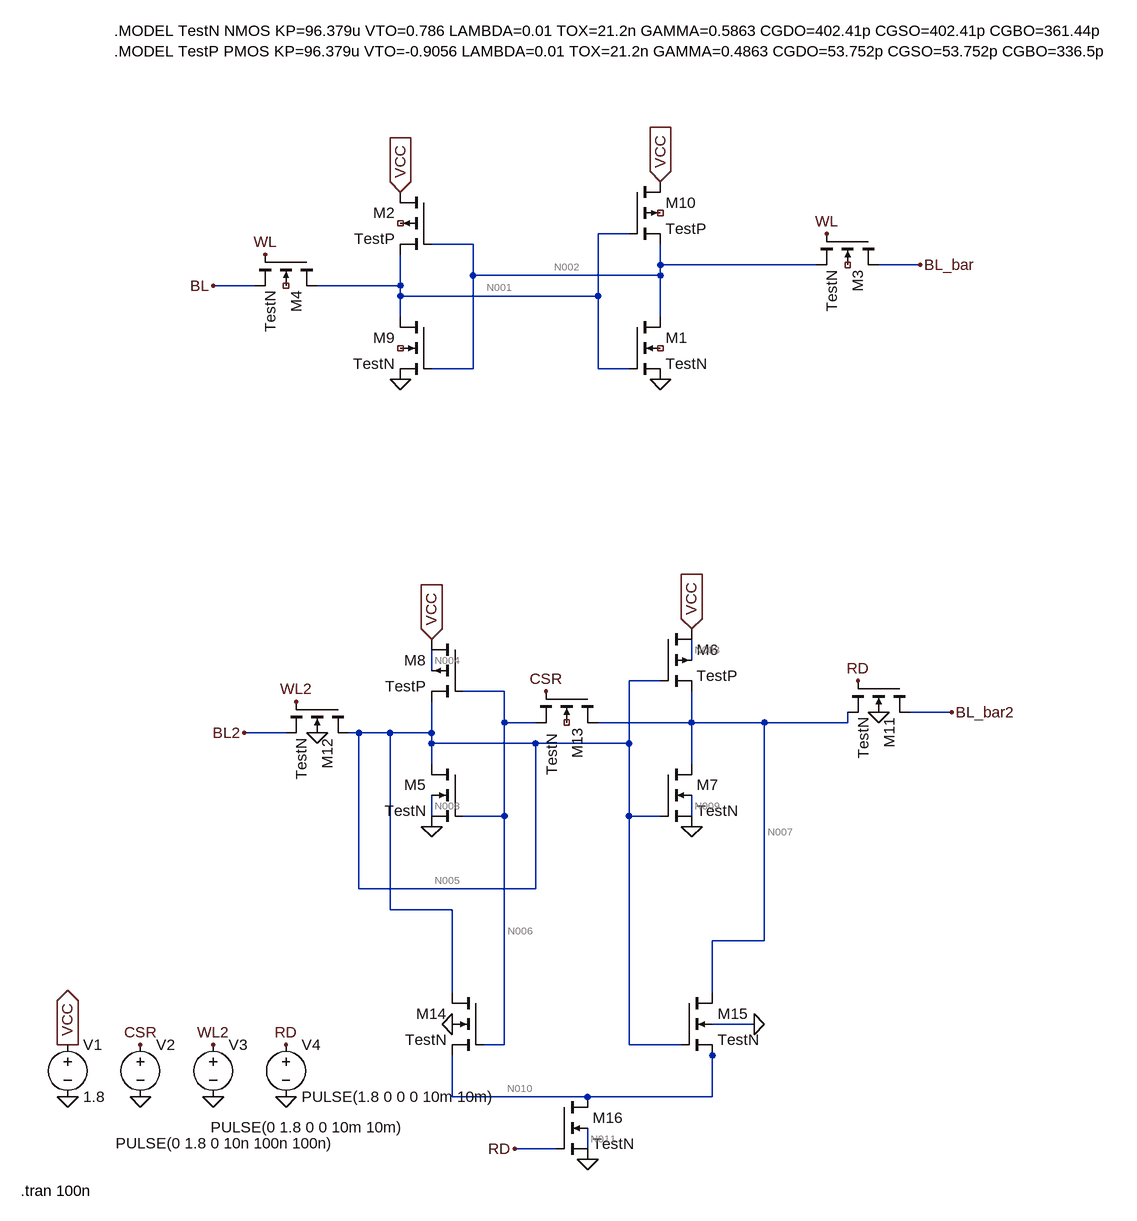
[diagram p0: schematic Draft2.asc]
Draft2.asc, the LTspice schematic file:
Version 4
SHEET 1 1456 1776
WIRE 640 288 592 288
WIRE 400 304 336 304
WIRE 688 336 688 304
WIRE 928 336 688 336
WIRE 1088 336 1024 336
WIRE 400 352 400 304
WIRE 688 352 688 336
WIRE 688 352 400 352
WIRE 64 368 0 368
WIRE 288 368 288 320
WIRE 288 368 160 368
WIRE 288 384 288 368
WIRE 592 384 592 288
WIRE 592 384 288 384
WIRE 288 416 288 384
WIRE 688 416 688 352
WIRE 400 496 400 352
WIRE 400 496 336 496
WIRE 592 496 592 384
WIRE 640 496 592 496
WIRE 736 944 736 912
WIRE 336 960 336 928
WIRE 688 976 640 976
WIRE 448 992 384 992
WIRE 1136 1024 1072 1024
WIRE 448 1040 448 992
WIRE 496 1040 448 1040
WIRE 736 1040 736 992
WIRE 736 1040 592 1040
WIRE 848 1040 736 1040
WIRE 976 1040 976 1024
WIRE 976 1040 848 1040
WIRE 112 1056 48 1056
WIRE 224 1056 208 1056
WIRE 272 1056 224 1056
WIRE 336 1056 336 1008
WIRE 336 1056 272 1056
WIRE 336 1072 336 1056
WIRE 496 1072 336 1072
WIRE 640 1072 640 976
WIRE 640 1072 496 1072
WIRE 336 1104 336 1072
WIRE 736 1104 736 1040
WIRE 336 1184 336 1152
WIRE 448 1184 448 1040
WIRE 448 1184 384 1184
WIRE 640 1184 640 1072
WIRE 688 1184 640 1184
WIRE 736 1184 736 1152
WIRE 224 1296 224 1056
WIRE 496 1296 496 1072
WIRE 496 1296 224 1296
WIRE 272 1328 272 1056
WIRE 368 1328 272 1328
WIRE 848 1376 848 1040
WIRE 848 1376 768 1376
WIRE 368 1456 368 1328
WIRE 768 1456 768 1376
WIRE 832 1504 768 1504
WIRE 448 1536 448 1184
WIRE 448 1536 416 1536
WIRE 640 1536 640 1184
WIRE 720 1536 640 1536
WIRE 768 1552 768 1536
WIRE 368 1616 368 1552
WIRE 576 1616 368 1616
WIRE 768 1616 768 1552
WIRE 768 1616 576 1616
WIRE 528 1696 464 1696
WIRE 576 1696 576 1664
FLAG 0 368 BL
FLAG 1088 336 BL_bar
FLAG 944 288 WL
FLAG 80 320 WL
FLAG 288 224 VCC
IOPIN 288 224 In
FLAG 688 208 VCC
IOPIN 688 208 In
FLAG 288 512 0
FLAG 688 512 0
FLAG 48 1056 BL2
FLAG 1136 1024 BL_bar2
FLAG 992 976 RD
FLAG 128 1008 WL2
FLAG 336 912 VCC
IOPIN 336 912 In
FLAG 736 896 VCC
IOPIN 736 896 In
FLAG 336 1200 0
FLAG 736 1200 0
FLAG 512 992 CSR
FLAG 576 1712 0
FLAG 464 1696 RD
FLAG 160 1056 0
FLAG 1024 1024 0
FLAG 832 1504 0
FLAG 368 1504 0
FLAG 112 1536 RD
FLAG -112 1536 CSR
FLAG 0 1536 WL2
FLAG -224 1536 VCC
IOPIN -224 1536 Out
FLAG 112 1616 0
FLAG 0 1616 0
FLAG -112 1616 0
FLAG -224 1616 0
SYMBOL nmos4 336 416 M0
SYMATTR InstName M9
SYMATTR Value TestN
SYMATTR Value2 l=10u w=20u
SYMBOL pmos4 640 208 R0
SYMATTR InstName M10
SYMATTR Value TestP
SYMATTR Value2 l=10u w=40u
SYMBOL nmos4 640 416 R0
SYMATTR InstName M1
SYMATTR Value TestN
SYMATTR Value2 l=10u w=20u
SYMBOL pmos4 336 224 M0
SYMATTR InstName M2
SYMATTR Value TestP
SYMATTR Value2 l=10u w=40u
SYMBOL nmos4 1024 288 R90
SYMATTR InstName M3
SYMATTR Value TestN
SYMATTR Value2 l=10u w=20u
SYMBOL nmos4 160 320 R90
SYMATTR InstName M4
SYMATTR Value TestN
SYMATTR Value2 l=10u w=20u
SYMBOL nmos4 384 1104 M0
SYMATTR InstName M5
SYMATTR Value TestN
SYMATTR Value2 l=10u w=20u
SYMBOL pmos4 688 896 R0
SYMATTR InstName M6
SYMATTR Value TestP
SYMATTR Value2 l=10u w=40u
SYMBOL nmos4 688 1104 R0
SYMATTR InstName M7
SYMATTR Value TestN
SYMATTR Value2 l=10u w=20u
SYMBOL pmos4 384 912 M0
SYMATTR InstName M8
SYMATTR Value TestP
SYMATTR Value2 l=10u w=40u
SYMBOL nmos4 1072 976 R90
SYMATTR InstName M11
SYMATTR Value TestN
SYMATTR Value2 l=10u w=20u
SYMBOL nmos4 208 1008 R90
SYMATTR InstName M12
SYMATTR Value TestN
SYMATTR Value2 l=10u w=20u
SYMBOL nmos4 592 992 R90
WINDOW 3 65 71 Left 2
SYMATTR Value TestN
SYMATTR InstName M13
SYMATTR Value2 l=10u w=20u
SYMBOL nmos4 416 1456 M0
SYMATTR InstName M14
SYMATTR Value TestN
SYMATTR Value2 l=10u w=20u
SYMBOL nmos4 720 1456 R0
SYMATTR InstName M15
SYMATTR Value TestN
SYMATTR Value2 l=10u w=20u
SYMBOL nmos4 528 1616 R0
SYMATTR InstName M16
SYMATTR Value TestN
SYMATTR Value2 l=10u w=20u
SYMBOL voltage -224 1520 R0
WINDOW 123 0 0 Left 0
WINDOW 39 0 0 Left 0
SYMATTR InstName V1
SYMATTR Value 1.8
SYMBOL voltage -112 1520 R0
WINDOW 3 -38 167 Left 2
WINDOW 123 0 0 Left 0
WINDOW 39 0 0 Left 0
SYMATTR Value PULSE(0 1.8 0 10n 100n 100n)
SYMATTR InstName V2
SYMBOL voltage 0 1520 R0
WINDOW 3 -4 143 Left 2
WINDOW 123 0 0 Left 0
WINDOW 39 0 0 Left 0
SYMATTR Value PULSE(0 1.8 0 0 10m 10m)
SYMATTR InstName V3
SYMBOL voltage 112 1520 R0
WINDOW 123 0 0 Left 0
WINDOW 39 0 0 Left 0
SYMATTR InstName V4
SYMATTR Value PULSE(1.8 0 0 0 10m 10m)
TEXT -152 -24 Left 2 !.MODEL TestN NMOS KP=96.379u VTO=0.786 LAMBDA=0.01 TOX=21.2n GAMMA=0.5863 CGDO=402.41p CGSO=402.41p CGBO=361.44p\n.MODEL TestP PMOS KP=96.379u VTO=-0.9056 LAMBDA=0.01 TOX=21.2n GAMMA=0.4863 CGDO=53.752p CGSO=53.752p CGBO=336.5p
TEXT -296 1760 Left 2 !.tran 100n

The netlist it stands for:
* Draft2.asc
M9 N001 N002 0 NC_01 TestN l=10u w=20u
M10 VCC N001 N002 NC_02 TestP l=10u w=40u
M1 N002 N001 0 NC_03 TestN l=10u w=20u
M2 VCC N002 N001 NC_04 TestP l=10u w=40u
M3 BL_bar WL N002 NC_05 TestN l=10u w=20u
M4 N001 WL BL NC_06 TestN l=10u w=20u
M5 N005 N006 0 N008 TestN l=10u w=20u
M6 VCC N005 N007 N003 TestP l=10u w=40u
M7 N007 N005 0 N009 TestN l=10u w=20u
M8 VCC N006 N005 N004 TestP l=10u w=40u
M11 BL_bar2 RD N007 0 TestN l=10u w=20u
M12 N005 WL2 BL2 0 TestN l=10u w=20u
M13 N007 CSR N006 NC_07 TestN l=10u w=20u
M14 N005 N006 N010 0 TestN l=10u w=20u
M15 N007 N005 N010 0 TestN l=10u w=20u
M16 N010 RD 0 N011 TestN l=10u w=20u
V1 VCC 0 1.8
V2 CSR 0 PULSE(0 1.8 0 10n 100n 100n)
V3 WL2 0 PULSE(0 1.8 0 0 10m 10m)
V4 RD 0 PULSE(1.8 0 0 0 10m 10m)
.model NMOS NMOS
.model PMOS PMOS
.lib standard.mos
.MODEL TestN NMOS KP=96.379u VTO=0.786 LAMBDA=0.01 TOX=21.2n GAMMA=0.5863 CGDO=402.41p CGSO=402.41p CGBO=361.44p
.MODEL TestP PMOS KP=96.379u VTO=-0.9056 LAMBDA=0.01 TOX=21.2n GAMMA=0.4863 CGDO=53.752p CGSO=53.752p CGBO=336.5p
.tran 100n
.backanno
.end

* Results of the author's LTspice run, read from the files saved beside the schematic
* Operating Point, zero values left out:
*   V(n001) = 859.1 mV
*   V(n002) = 859.1 mV
*   V(vcc) = 1.8 V
*   V(bl_bar) = 685.3 mV
*   V(bl) = 685.3 mV
*   V(n005) = 850.9 mV
*   V(n006) = 852.3 mV
*   V(n008) = 104.1 mV
*   V(n007) = 1.068 V
*   V(n003) = 1.661 V
*   V(n009) = 111.8 mV
*   V(n004) = 1.659 V
*   V(bl_bar2) = 779.5 mV
*   V(rd) = 1.8 V
*   V(bl2) = 420.5 mV
*   V(n010) = 3.659 mV
*   V(n011) = 1.331 mV
*   Id(M9) = 1.232 µA
*   Is(M9) = -1.232 µA
*   Id(M1) = 1.232 µA
*   Is(M1) = -1.232 µA
*   Id(M5) = 1.086 µA
*   Is(M5) = -1.086 µA
*   Id(M7) = 1.12 µA
*   Is(M7) = -1.12 µA
*   Ib(M11) = -1.867 pA
*   Is(M11) = 1.867 pA
*   Id(M12) = 1.291 pA
*   Ib(M12) = -1.291 pA
*   Id(M14) = 365 nA
*   Is(M14) = -365 nA
*   Id(M15) = 349.3 nA
*   Ib(M15) = -1.083 pA
*   Is(M15) = -349.3 nA
*   Id(M16) = 714.3 nA
*   Is(M16) = -714.3 nA
*   Id(M10) = 1.233 µA
*   Ib(M10) = -1.659 pA
*   Is(M10) = -1.233 µA
*   Id(M2) = 1.233 µA
*   Ib(M2) = -1.659 pA
*   Is(M2) = -1.233 µA
*   Id(M6) = 1.471 µA
*   Ib(M6) = -1.663 pA
*   Is(M6) = -1.471 µA
*   Id(M8) = 1.452 µA
*   Ib(M8) = -1.66 pA
*   Is(M8) = -1.452 µA
*   I(V1) = -5.385 µA
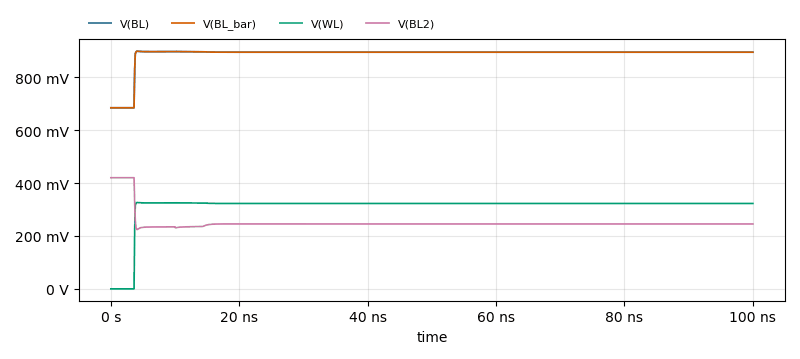
[diagram p1: Transient Analysis of Draft2.asc, plotted from the saved traces]
* Transient Analysis, 1 run:
*   V(BL): min 685.3 mV, max 899.1 mV, average 887.9 mV, rms 888.8 mV, last 895.4 mV
*   V(BL_bar): min 685.3 mV, max 899.1 mV, average 887.9 mV, rms 888.8 mV, last 895.4 mV
*   V(WL): min 0 V, max 326.7 mV, average 311.3 mV, rms 317.2 mV, last 323 mV
*   V(BL2): min 224.1 mV, max 420.5 mV, average 250.7 mV, rms 252.9 mV, last 245.5 mV